# Altium project Shy-Mirror-master-revB.PrjPcb
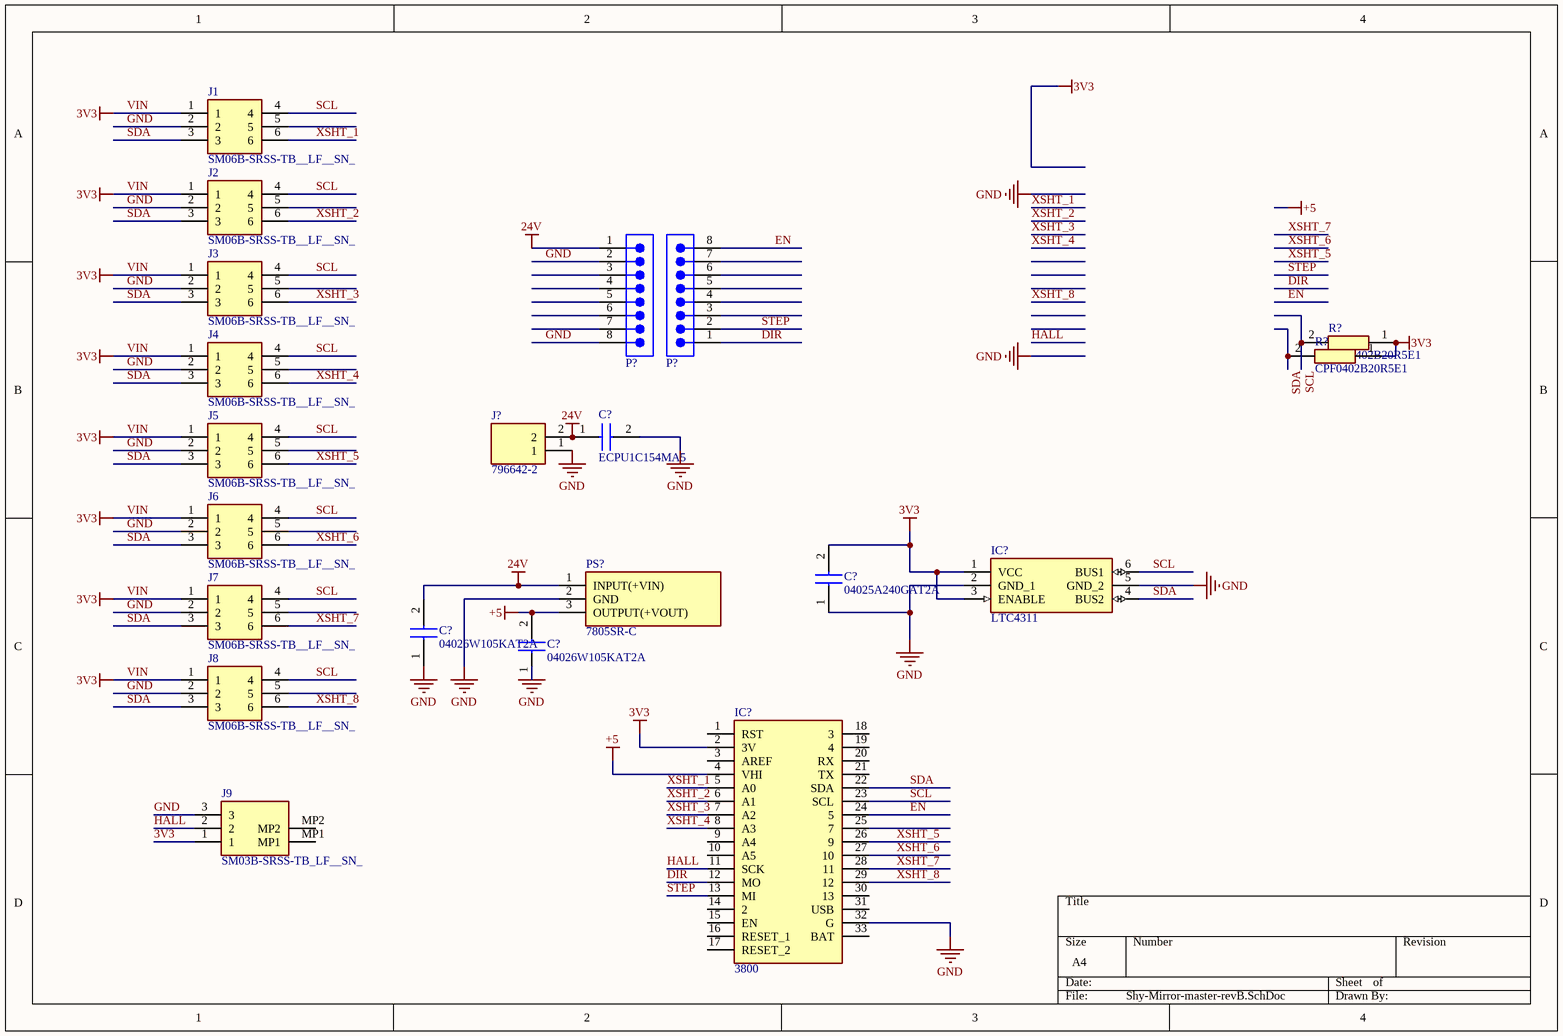
[diagram p0: Shy-Mirror-master-revB.SchDoc]
1 sheet, 21 parts. Net scope: global (net labels, ports and power ports of the same name join across sheets).
Board file: Shy-Mirror-master-revB.PcbDoc

## Sheet Shy-Mirror-master-revB.SchDoc
size A4; SheetNumber: 1; SheetTotal: 1

### Parts
(Parts that share a designator on the sheet are numbered #1, #2 ... from top to bottom, then left to right.)
C?#1  ECPU1C154MA5  [ECPU1C154MA5]
C?#2  04025A240GAT2A  [CAPC1005X56N]
C?#3  04026W105KAT2A  [CAPC1005X56N]
C?#4  04026W105KAT2A  [CAPC1005X56N]
IC?#1  LTC4311  [SOP65P210X100-6N]
IC?#2  3800  [3800]
J1  SM06B-SRSS-TB__LF__SN_  [SM06B-SRSS-TB]
J2  SM06B-SRSS-TB__LF__SN_  [SM06B-SRSS-TB]
J3  SM06B-SRSS-TB__LF__SN_  [SM06B-SRSS-TB]
J4  SM06B-SRSS-TB__LF__SN_  [SM06B-SRSS-TB]
J5  SM06B-SRSS-TB__LF__SN_  [SM06B-SRSS-TB]
J6  SM06B-SRSS-TB__LF__SN_  [SM06B-SRSS-TB]
J7  SM06B-SRSS-TB__LF__SN_  [SM06B-SRSS-TB]
J8  SM06B-SRSS-TB__LF__SN_  [SM06B-SRSS-TB]
J9  SM03B-SRSS-TB_LF__SN_  [SM03BSRSSTBLFSN]
J?  796642-2  [SHDR2W102P0X500_1X2_1200X835X1230P]
P?#1  61300811121  [61300811121]  (value not drawn)
P?#2  61300811121  [61300811121]  (value not drawn)
PS?  7805SR-C  [7805SRC]
R?#1  CPF0402B20R5E1  [RESC1005X35N]
R?#2  CPF0402B20R5E1  [RESC1005X35N]

### Nets
3V3: C?#2.2 IC?#1.1(VCC) IC?#1.3(ENABLE) IC?#2.2(3V) J1.1 J2.1 J3.1 J4.1 J5.1 J6.1 J7.1 J8.1 J9.1 R?#1.1 R?#2.1  [also labelled VIN]
24V: C?#1.1 C?#3.2 J?.2 P?#1.1 PS?.1(INPUT(+VIN))
+5: C?#4.2 IC?#2.4(VHI) PS?.3(OUTPUT(+VOUT))
GND: C?#1.2 C?#2.1 C?#3.1 C?#4.1 IC?#1.2(GND_1) IC?#1.5(GND_2) IC?#2.32(G) J1.2 J2.2 J3.2 J4.2 J5.2 J6.2 J7.2 J8.2 J9.3 J?.1 P?#1.2 P?#1.8 PS?.2(GND)
DIR: IC?#2.12(MO) P?#2.1
EN: IC?#2.24(5) P?#2.8
HALL: IC?#2.11(SCK) J9.2
SCL: IC?#1.6(BUS1) IC?#2.23(SCL) J1.4 J2.4 J3.4 J4.4 J5.4 J6.4 J7.4 J8.4 R?#1.2
SDA: IC?#1.4(BUS2) IC?#2.22(SDA) J1.3 J2.3 J3.3 J4.3 J5.3 J6.3 J7.3 J8.3 R?#2.2
STEP: IC?#2.13(MI) P?#2.2
XSHT_1: IC?#2.5(A0) J1.6
XSHT_2: IC?#2.6(A1) J2.6
XSHT_3: IC?#2.7(A2) J3.6
XSHT_4: IC?#2.8(A3) J4.6
XSHT_5: IC?#2.26(9) J5.6
XSHT_6: IC?#2.27(10) J6.6
XSHT_7: IC?#2.28(11) J7.6
XSHT_8: IC?#2.29(12) J8.6

Not connected (* = marked no-connect by the designer): IC?#2 1(RST) 3(AREF) 9(A4) 10(A5) 14(2) 15(EN) 16(RESET_1) 17(RESET_2) 18(3) 19(4) 20(RX) 21(TX) 25(7) 30(13) 31(USB) 33(BAT); J1 5; J2 5; J3 5; J4 5; J5 5; J6 5; J7 5; J8 5; J9 MP1 MP2; P?#1 3 4 5 6 7; P?#2 3 4 5 6 7

### Library data of the parts
C?#1 = ECPU1C154MA5: Capacitor; Manufacturer_Name: Panasonic; Datasheet Link: http://industrial.panasonic.com/cdbs/www-data/pdf/RDI0000/ABD0000C178.pdf; Height: 1mm; Manufacturer_Part_Number: ECPU1C154MA5
C?#2 = 04025A240GAT2A: Capacitor; Manufacturer_Name: Kyocera AVX; Datasheet Link: http://www.mouser.com/catalog/supplier/library/pdf/AVXSurfaceMountCeramic.pdf; Height: 0.56mm; Manufacturer_Part_Number: 04025A240GAT2A; Mouser Part Number: 581-04025A240GAT2A; Mouser Price/Stock: https://www.mouser.co.uk/ProductDetail/AVX/04025A240GAT2A?qs=ZBeOGGPQgEEcxmEZelA7Mg%3D%3D
C?#3 C?#4 = 04026W105KAT2A: Capacitor; Manufacturer_Name: Kyocera AVX; Datasheet Link: http://www.mouser.com/catalog/supplier/library/pdf/AVXSurfaceMountCeramic.pdf; Height: 0.56mm; Manufacturer_Part_Number: 04026W105KAT2A; Mouser Part Number: 581-04026W105KAT2A; Mouser Price/Stock: https://www.mouser.co.uk/ProductDetail/KYOCERA-AVX/04026W105KAT2A?qs=QKPlp7%252B%252BMySX2WX75ls0%252Bw%3D%3D
IC?#1 = LTC4311: Integrated Circuit; Manufacturer_Name: Analog Devices; Datasheet Link: http://cds.linear.com/docs/en/datasheet/4311fa.pdf; Height: 1mm; Manufacturer_Part_Number: LTC4311; Mouser Part Number: N/A; Mouser Price/Stock: https://www.mouser.co.uk/ProductDetail/Analog-Devices/LTC4311?qs=Imq1NPwxi76zvKPfOroLUg%3D%3D
IC?#2 = 3800: Integrated Circuit; Manufacturer_Name: Adafruit; Datasheet Link: https://cdn-learn.adafruit.com/downloads/pdf/introducing-adafruit-itsybitsy-m4.pdf; Height: 4.2mm; Manufacturer_Part_Number: 3800; Mouser Part Number: 485-3800; Mouser Price/Stock: https://www.mouser.co.uk/ProductDetail/Adafruit/3800?qs=%252BEew9%252B0nqrDEEFcTIFoyAg%3D%3D; Arrow Part Number: 3800; Arrow Price/Stock: https://www.arrow.com/en/products/3800/adafruit-industries
J1-J8 = SM06B-SRSS-TB__LF__SN_: Connector; Manufacturer_Name: JST (JAPAN SOLDERLESS TERMINALS); Manufacturer_Part_Number: SM06B-SRSS-TB (LF)(SN); Datasheet Link: http://uk.rs-online.com/web/p/products/5468827
J9 = SM03B-SRSS-TB_LF__SN_: Connector; Manufacturer_Name: JST (JAPAN SOLDERLESS TERMINALS); Manufacturer_Part_Number: SM03B-SRSS-TB(LF)(SN); Datasheet Link: http://www.jst-mfg.com/product/pdf/eng/eSR.pdf; Height: 2.9mm; Mouser Part Number: 306-SM03BSRSSTBLFSNP; Mouser Price/Stock: https://www.mouser.co.uk/ProductDetail/JST-Commercial/SM03B-SRSS-TBLFSN?qs=cdbOS8ANM9DY%2Fg%2FPQv5Kng%3D%3D; Arrow Part Number: SM03B-SRSS-TB(LF)(SN); Arrow Price/Stock: https://www.arrow.com/en/products/sm03b-srss-tb-lf-sn/jst-manufacturing?region=europe
J? = 796642-2: Connector; Manufacturer_Name: TE Connectivity; Datasheet Link: https://www.te.com/commerce/DocumentDelivery/DDEController?Action=srchrtrv&DocNm=1-773958-1&DocType=Data%20Sheet&DocLang=English&PartCntxt=796642-2&DocFormat=pdf; Height: 12.3mm; Manufacturer_Part_Number: 796642-2; Mouser Part Number: 571-796642-2; Mouser Price/Stock: https://www.mouser.co.uk/ProductDetail/TE-Connectivity/796642-2?qs=QSmEGMYP8RQwet%252Bjzuv6gg%3D%3D; Arrow Part Number: 796642-2; Arrow Price/Stock: https://www.arrow.com/en/products/796642-2/te-connectivity?region=nac
P?#1 P?#2 = 61300811121: WR-PHD Pin Header, THT, Vertical, pitch 2.54mm, 1 Row, 8P; Manufacturer: Wurth Elektronik; Contact Resistance: 20mOhm; Rated Current: 3A; Working Voltage: 250V; Withstanding Voltage: 500V; Manufacturer Part Number: 61300811121; Category: Board-to-Board Connectors; Match Code: WR-PHD; ComponentLink1Description: Website Link; ComponentLink1URL: https://www.we-online.com/redexpert/article/61300811121?ad; ComponentLink2Description: Datasheet Link; ComponentLink2URL: https://www.we-online.com/redexpert/spec/61300811121?ad; Mount: Through Hole; Operating Temperature Max: 105°C; Operating Temperature Min: -40°C; Packaging: Bag; Gender: Pin Header; Number of Pins: 8; Number of Rows: 1; Orientation: Vertical; Pitch: 2.54mm
PS? = 7805SR-C: Power Supply; Manufacturer_Name: Murata Electronics; Datasheet Link: https://componentsearchengine.com/Datasheets/1/7805SR-C.pdf; Height: 19.1mm; Manufacturer_Part_Number: 7805SR-C; Mouser Part Number: 580-7805SR-C; Mouser Price/Stock: https://www.mouser.co.uk/ProductDetail/Murata-Power-Solutions/7805SR-C?qs=35WhQNrE6p3r8osawIMOlg%3D%3D; Arrow Part Number: 7805SR-C; Arrow Price/Stock: https://www.arrow.com/en/products/7805sr-c/murata-power-solutions?region=nac
R?#1 R?#2 = CPF0402B20R5E1: Resistor; Manufacturer_Name: TE Connectivity; Datasheet Link: http://www.farnell.com/datasheets/1786775.pdf; Height: 0.35mm; Manufacturer_Part_Number: CPF0402B20R5E1